# Altium project drv8305_instaspin_driver.PrjPcb
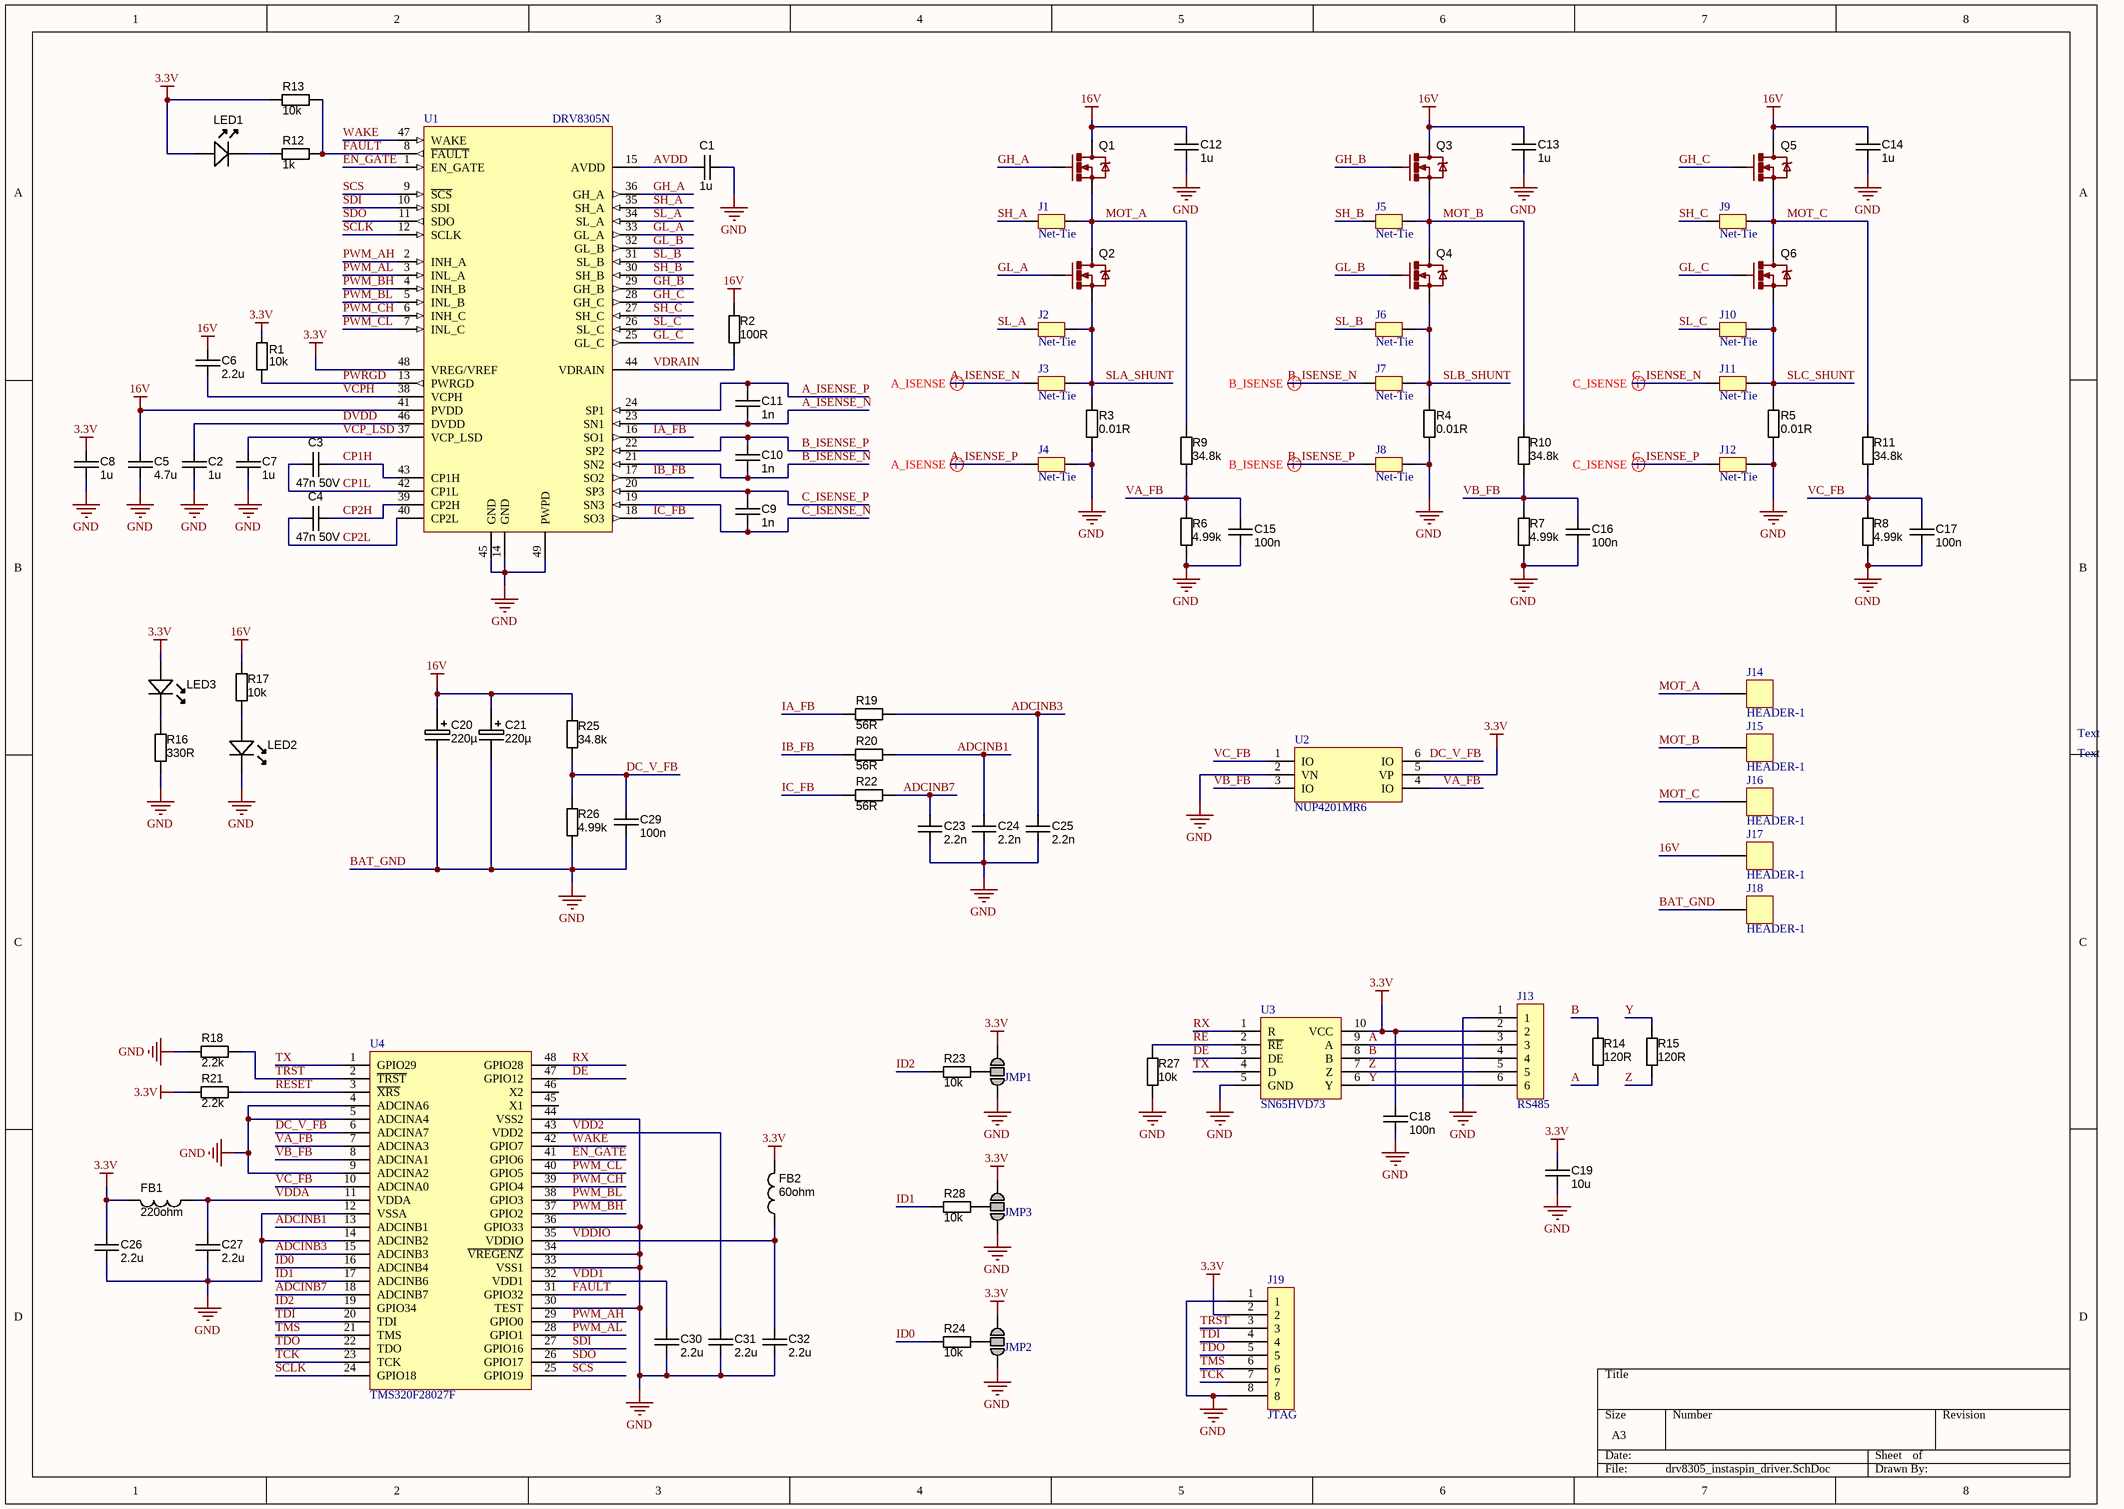
[diagram p0: drv8305_instaspin_driver.SchDoc]
1 sheet, 95 parts. Net scope: global (net labels, ports and power ports of the same name join across sheets).
Board file: drv8305_instaspin_driver.PcbDoc

## Sheet drv8305_instaspin_driver.SchDoc
size A3

### Parts
C1  1u  [CAPC1608X90N]
C2  1u  [CAPC1608X90N]
C3  47n 50V  [CAPC1608X90N]
C4  47n 50V  [CAPC1608X90N]
C5  4.7u  [CAPC3216X180N]
C6  2.2u  [CAPC3216X180N]
C7  1u  [CAPC1608X90N]
C8  1u  [CAPC1608X90N]
C9  1n  [CAPC1608X90N]
C10  1n  [CAPC1608X90N]
C11  1n  [CAPC1608X90N]
C12  1u  [CAPC1608X90N]
C13  1u  [CAPC1608X90N]
C14  1u  [CAPC1608X90N]
C15  100n  [CAPC1608X90N]
C16  100n  [CAPC1608X90N]
C17  100n  [CAPC1608X90N]
C18  100n  [CAPC1608X90N]
C19  10u  [CAPC3216X180N]
C20  220µ  [CAP_ELEC_6.3x4.2]
C21  220µ  [CAP_ELEC_6.3x4.2]
C23  2.2n  [CAPC1608X90N]
C24  2.2n  [CAPC1608X90N]
C25  2.2n  [CAPC1608X90N]
C26  2.2u  [CAPC1608X90N]
C27  2.2u  [CAPC1608X90N]
C29  100n  [CAPC1608X90N]
C30  2.2u  [CAPC1608X90N]
C31  2.2u  [CAPC1608X90N]
C32  2.2u  [CAPC1608X90N]
FB1  220ohm  [INDC1608N]
FB2  60ohm  [INDC1608N]
J1  Net-Tie  [NET-TIE-0602]  (net tie, no BOM)
J2  Net-Tie  [NET-TIE-0602]  (net tie, no BOM)
J3  Net-Tie  [NET-TIE-0602]  (net tie, no BOM)
J4  Net-Tie  [NET-TIE-0602]  (net tie, no BOM)
J5  Net-Tie  [NET-TIE-0602]  (net tie, no BOM)
J6  Net-Tie  [NET-TIE-0602]  (net tie, no BOM)
J7  Net-Tie  [NET-TIE-0602]  (net tie, no BOM)
J8  Net-Tie  [NET-TIE-0602]  (net tie, no BOM)
J9  Net-Tie  [NET-TIE-0602]  (net tie, no BOM)
J10  Net-Tie  [NET-TIE-0602]  (net tie, no BOM)
J11  Net-Tie  [NET-TIE-0602]  (net tie, no BOM)
J12  Net-Tie  [NET-TIE-0602]  (net tie, no BOM)
J13  RS485  [MICRO-MATCH-6]
J14  HEADER-1  [2MM-BANANA-VIA-BOTTOM-PAD]
J15  HEADER-1  [2MM-BANANA-VIA-BOTTOM-PAD]
J16  HEADER-1  [2MM-BANANA-VIA-BOTTOM-PAD]
J17  HEADER-1  [2MM-BANANA-VIA-BOTTOM-PAD]
J18  HEADER-1  [2MM-BANANA-VIA-BOTTOM-PAD]
J19  JTAG  [MICRO-MATCH-8]
JMP1  JUMPER  [JUMPER-SMD-3WAY-0303]  (value not drawn)
JMP2  JUMPER  [JUMPER-SMD-3WAY-0303]  (value not drawn)
JMP3  JUMPER  [JUMPER-SMD-3WAY-0303]  (value not drawn)
LED1  LED Orange  [LED-0603-GREEN]  (value not drawn)
LED2  LED White  [LED-0603-GREEN]  (value not drawn)
LED3  LED White  [LED-0603-GREEN]  (value not drawn)
Q1  MOSFET-N  [SOT669]  (value not drawn)
Q2  MOSFET-N  [SOT669]  (value not drawn)
Q3  MOSFET-N  [SOT669]  (value not drawn)
Q4  MOSFET-N  [SOT669]  (value not drawn)
Q5  MOSFET-N  [SOT669]  (value not drawn)
Q6  MOSFET-N  [SOT669]  (value not drawn)
R1  10k  [RESC1608X55N]
R2  100R  [RESC1608X55N]
R3  0.01R  [RESC6332X70N]
R4  0.01R  [RESC6332X70N]
R5  0.01R  [RESC6332X70N]
R6  4.99k  [RESC1608X55N]
R7  4.99k  [RESC1608X55N]
R8  4.99k  [RESC1608X55N]
R9  34.8k  [RESC1608X55N]
R10  34.8k  [RESC1608X55N]
R11  34.8k  [RESC1608X55N]
R12  1k  [RESC1608X55N]
R13  10k  [RESC1608X55N]
R14  120R  [RESC1608X55N]
R15  120R  [RESC1608X55N]
R16  330R  [RESC1608X55N]
R17  10k  [RESC1608X55N]
R18  2.2k  [RESC1608X55N]
R19  56R  [RESC1608X55N]
R20  56R  [RESC1608X55N]
R21  2.2k  [RESC1608X55N]
R22  56R  [RESC1608X55N]
R23  10k  [RESC1608X55N]
R24  10k  [RESC1608X55N]
R25  34.8k  [RESC1608X55N]
R26  4.99k  [RESC1608X55N]
R27  10k  [RESC1608X55N]
R28  10k  [RESC1608X55N]
U1  DRV8305N  [PQFP48_PAD]
U2  NUP4201MR6  [TSOP-6]
U3  SN65HVD73  [SOP10]
U4  TMS320F28027F  [PQFP48]

### Nets
3.3V: C8.2 C18.1 C19.1 C26.2 FB1.2 FB2.2 J13.2 J19.2 JMP1.3 JMP2.3 JMP3.3 LED1.A LED3.A R1.1 R13.1 R21.2 U1.48(VREG/VREF) U2.5(VP) U3.10(VCC)
16V: C5.2 C6.2 C12.1 C13.1 C14.1 C20.1 C21.1 J17.1 Q1.D Q3.D Q5.D R2.2 R17.2 R25.2 U1.41(PVDD)
BAT_GND: C1.1 C2.1 C5.1 C7.1 C8.1 C12.2 C13.2 C14.2 C15.2 C16.2 C17.2 C18.2 C19.2 C20.2 C21.2 C23.2 C24.2 C25.2 C26.1 C27.2 C29.2 C30.2 C31.2 C32.2 J4.2 J8.2 J12.2 J13.1 J18.1 J19.1 J19.8 JMP1.1 JMP2.1 JMP3.1 LED2.K R3.2 R4.2 R5.2 R6.1 R7.1 R8.1 R16.1 R18.1 R26.1 R27.2 U1.14(GND) U1.45(GND) U1.49(PWPD) U2.2(VN) U3.5(GND) U4.4(ADCINA6) U4.5(ADCINA4) U4.9(ADCINA2) U4.12(VSSA) U4.14(ADCINB2) U4.30(TEST) U4.33(VSS1) U4.34(~{VREGENZ}) U4.36(GPIO33) U4.44(VSS2)  [also labelled GND]
A: J13.3 R14.1 U3.9(A)
A_ISENSE_N: C11.1 J3.1 U1.23(SN1)
A_ISENSE_P: C11.2 J4.1 U1.24(SP1)
ADCINB1: C24.1 R20.1 U4.13(ADCINB1)
ADCINB3: C25.1 R19.1 U4.15(ADCINB3)
ADCINB7: C23.1 R22.1 U4.18(ADCINB7)
AVDD: C1.2 U1.15(AVDD)
B: J13.4 R14.2 U3.8(B)
B_ISENSE_N: C10.1 J7.1 U1.21(SN2)
B_ISENSE_P: C10.2 J8.1 U1.22(SP2)
C_ISENSE_N: C9.1 J11.1 U1.19(SN3)
C_ISENSE_P: C9.2 J12.1 U1.20(SP3)
CP1H: C3.1 U1.43(CP1H)
CP1L: C3.2 U1.42(CP1L)
CP2H: C4.1 U1.39(CP2H)
CP2L: C4.2 U1.40(CP2L)
DC_V_FB: C29.1 R25.1 R26.2 U2.6(IO) U4.6(ADCINA7)
DE: U3.3(DE) U4.47(GPIO12)
DVDD: C2.2 U1.46(DVDD)
EN_GATE: U1.1(EN_GATE) U4.41(GPIO6)
FAULT: R12.2 R13.2 U1.8(~{FAULT}) U4.31(GPIO32)
GH_A: Q1.G U1.36(GH_A)
GH_B: Q3.G U1.29(GH_B)
GH_C: Q5.G U1.28(GH_C)
GL_A: Q2.G U1.33(GL_A)
GL_B: Q4.G U1.32(GL_B)
GL_C: Q6.G U1.25(GL_C)
IA_FB: R19.2 U1.16(SO1)
IB_FB: R20.2 U1.17(SO2)
IC_FB: R22.2 U1.18(SO3)
ID0: R24.2 U4.16(ADCINB4)
ID1: R28.2 U4.17(ADCINB6)
ID2: R23.2 U4.19(GPIO34)
MOT_A: J1.2 J14.1 Q1.S Q2.D R9.2
MOT_B: J5.2 J15.1 Q3.S Q4.D R10.2
MOT_C: J9.2 J16.1 Q5.S Q6.D R11.2
PWM_AH: U1.2(INH_A) U4.29(GPIO0)
PWM_AL: U1.3(INL_A) U4.28(GPIO1)
PWM_BH: U1.4(INH_B) U4.37(GPIO2)
PWM_BL: U1.5(INL_B) U4.38(GPIO3)
PWM_CH: U1.6(INH_C) U4.39(GPIO4)
PWM_CL: U1.7(INL_C) U4.40(GPIO5)
PWRGD: R1.2 U1.13(PWRGD)
RE: R27.1 U3.2(~{RE})
RESET: R21.1 U4.3(~{XRS})
RX: U3.1(R) U4.48(GPIO28)
SCLK: U1.12(SCLK) U4.24(GPIO18)
SCS: U1.9(~{SCS}) U4.25(GPIO19)
SDI: U1.10(SDI) U4.27(GPIO16)
SDO: U1.11(SDO) U4.26(GPIO17)
SH_A: J1.1 U1.35(SH_A)
SH_B: J5.1 U1.30(SH_B)
SH_C: J9.1 U1.27(SH_C)
SL_A: J2.1 U1.34(SL_A)
SL_B: J6.1 U1.31(SL_B)
SL_C: J10.1 U1.26(SL_C)
SLA_SHUNT: J2.2 J3.2 Q2.S R3.1
SLB_SHUNT: J6.2 J7.2 Q4.S R4.1
SLC_SHUNT: J10.2 J11.2 Q6.S R5.1
TCK: J19.7 U4.23(TCK)
TDI: J19.4 U4.20(TDI)
TDO: J19.5 U4.22(TDO)
TMS: J19.6 U4.21(TMS)
TRST: J19.3 R18.2 U4.2(~{TRST})
TX: U3.4(D) U4.1(GPIO29)
VA_FB: C15.1 R6.2 R9.1 U2.4(IO) U4.7(ADCINA3)
VB_FB: C16.1 R7.2 R10.1 U2.3(IO) U4.8(ADCINA1)
VC_FB: C17.1 R8.2 R11.1 U2.1(IO) U4.10(ADCINA0)
VCP_LSD: C7.2 U1.37(VCP_LSD)
VCPH: C6.1 U1.38(VCPH)
VDD1: C30.1 U4.32(VDD1)
VDD2: C31.1 U4.43(VDD2)
VDDA: C27.1 FB1.1 U4.11(VDDA)
VDDIO: C32.1 FB2.1 U4.35(VDDIO)
VDRAIN: R2.1 U1.44(VDRAIN)
WAKE: U1.47(WAKE) U4.42(GPIO7)
Y: J13.6 R15.2 U3.6(Y)
Z: J13.5 R15.1 U3.7(Z)
NetJMP1_2: JMP1.2 R23.1
NetJMP2_2: JMP2.2 R24.1
NetJMP3_2: JMP3.2 R28.1
NetLED1_K: LED1.K R12.1
NetLED2_A: LED2.A R17.1
NetLED3_K: LED3.K R16.2

Not connected (* = marked no-connect by the designer): U4 45(X1) 46(X2)

### Layout directives
differential pair: A_ISENSE_N, A_ISENSE_P, B_ISENSE_N, B_ISENSE_P, C_ISENSE_N, C_ISENSE_P

### Notes on the sheet
- Text

### Library data of the parts
C1-C4 C7-C19 C23-C27 C29-C32 = CAPC_1u_0603_X7R_16V_10%: Capacitor SMD Cer 1uF 10% 16V X7R 0603; Manufacturer 1: TDK Corporation; Manufacturer Part Number 1: C1608X7R1C105K; Ratings: 16V; X7R; Material: ceramic; SCDType: spec; Value: 1µ; Package / Case: 0603 (1608 metric); Tolerance: ±10%; Supplier 1: Digi-Key; Supplier Part Number 1: 445-1604-1-ND; ComponentLink1URL: http://product.tdk.com/capacitor/mlcc/en/documents/mlcc_commercial_general_en.pdf; ComponentLink1Description: http://product.tdk.com/capacitor/mlcc/en/documents/mlcc_commercial_general_en.pdf
C5 C6 = CAPC_6n8_1206_NP0_50V: Capacitor SMD Cer 6.8nF 5% 50V NP0 1206; Manufacturer 1: TDK Corporation; Manufacturer Part Number 1: C3216C0G1H682J/0.60; Ratings: 50V; NP0; Material: Ceramic NP0; SCDType: spec; Value: 47u; Tolerance: ±5%; Package / Case: 1206 (3216 metric); Supplier 1: Digi-Key; Supplier Part Number 1: 445-4005-1-ND
C20 C21 = CAPE_470u_16V_THT: Capacitor THT Alum Elec 470uF 20% 16V; Manufacturer 1: NICHICON; Manufacturer Part Number 1: UHM1C471MPD6; Ratings: 16V; 105°C; Material: Al Electrolytic; SCDType: undef; Package / Case: Radial; Tolerance: ±20%; Supplier 1: Newark; Supplier Part Number 1: 54K8151; Manufacturer 2: JD; Manufacturer Part Number 2: GT470UF16V_10x12mm; Value: 220µ
FB1 FB2 = FERRITE_120R-100MHz_0603: Ferrite bead 120 Ohm at 100 MHz 2A 0603 SMD; Manufacturer 1: Murata Electronics North America; Manufacturer Part Number 1: BLM18PG121SN1D; Current: 900mA; DC Resistance (DCR): 172.9 mOhm Max; Frequency - Self Resonant: 23MHz; Frequency - Test: 100kHz; Impedance @ Frequency: 120 Ohm @ 100MHz; Filter Type: Differential Mode - Single; Number of Lines: 1; Ratings: 2 A; 50 mO DC; Value: 120R @ 100 MHz; SCDType: source; Current - Saturation: 900mA; Current - Temperature Rise: 900mA; Applications: Power Supplies; Package / Case: 1210 (3225 Metric); Operating Temperature: -40°C ~ 105°C; ComponentLink1URL: http://www.yuden.co.jp/ut/product/pdf/wound02_e.pdf; ComponentLink1Description: http://www.yuden.co.jp/ut/product/pdf/wound02_e.pdf; Supplier 1: Digi-Key; Supplier Part Number 1: 490-1037-1-ND; Current Rating: 2A; Mounting Type: Surface Mount; Height (Max): 0.037" (0.95mm); Size / Dimension: 0.063" L x 0.031" W (1.60mm x 0.80mm); ComponentLink2URL: http://search.murata.co.jp/Ceramy/image/img/PDF/ENG/L0110S0100BLM18P.pdf; ComponentLink2Description: http://search.murata.co.jp/Ceramy/image/img/PDF/ENG/L0110S0100BLM18P.pdf
J13 = HEADER-6
J19 = HEADER-8
JMP1-JMP3 = JUMPER-SMD-3WAY
LED1-LED3 = LED_SMD_Green_0603_525nm_350mcd: LED 0603 SMD Green 525nm 350mcd 20mA; Manufacturer 1: Kingbright; Manufacturer Part Number 1: APT1608ZGCK; Material: InGaN; Ratings: 200mcd min; 350 mcd typ @ 20mA; Voltage - Forward (Vf) @ 10mA: 3.1V; Viewing Angle: 120°; Lens Style/Size: Rectangle with Flat Top, 1.2mm x 0.8mm; Voltage - Forward (Vf) @ 20mA: 3.3V; SCDType: source; Package / Case: 0603 (1608 metric); Color: Green; Current - Test: 20mA; Manufacturer 2: Kingbright Company LLC; Manufacturer Part Number 2: APT1608-WAP24; Supplier 1: Mouser; Supplier Part Number 1: 604-APT1608ZGCK; ComponentLink1URL: http://www.mouser.com/ds/2/216/APT1608ZGCK-262051.pdf; ComponentLink1Description: http://www.mouser.com/ds/2/216/APT1608ZGCK-262051.pdf; ComponentLink2Description: APT1608-WAP24 Datasheet; ComponentLink2URL: \\SVFI2\PBLShare\Eng\Electrical Engineering\Hardware\Altium\Libraries and Templates\Unreleased Components\Part Number Request 2013-10-02\APT1608-WAP24(Ver.1B).pdf
Q1-Q6 = MOSFET-N: PROD_ID: IC-08089
R1 R2 R6-R28 = RES_1K5_0603_5%: Resistor SMD chip 1.5k Ohm 0.1W 5% 0603; Manufacturer 1: Yageo; Manufacturer Part Number 1: RC0603JR-071K5L; Ratings: 1/10 W; Value: 1K5; SCDType: spec; Package / Case: 0603 (1608 metric); Tolerance: ±5%; Material: thick film; Supplier 1: Digi-Key; Supplier Part Number 1: 311-1.5KGRCT-ND
R3-R5 = RES_3K3_2512_5%: Resistor SMD chip 3.3k Ohm 1W 5% 2512; Manufacturer 1: Vishay/Dale; Manufacturer Part Number 1: CRCW25123K30JNEG; Value: 3K3; SCDType: spec; Tolerance: ±5%; Ratings: 1W; Material: Thick Film; Supplier 1: Digi-Key; Supplier Part Number 1: 541-3.3KXCT-ND; Package / Case: 2512 (6332 metric)
U1 = DRV8305
U3 = SN65HVD3086E